# EasyEDA Pro project testpcb .eprj

# Schematic Test pcb for PUF
Board Name: Test pcb for PUF; Create Date: 2026-02-06; Page Name: Sheet_1; Project Name: PCB Test Board; Schematic Name: Test pcb for PUF; Update Date: 2026-02-05; Add into BOM: yes; Company: Your Company; Convert to PCB: yes; Date: 2026-02-02; Draw By: imonlylegendary; REV: 1.0; Sheet: 1/1; spicePre: .
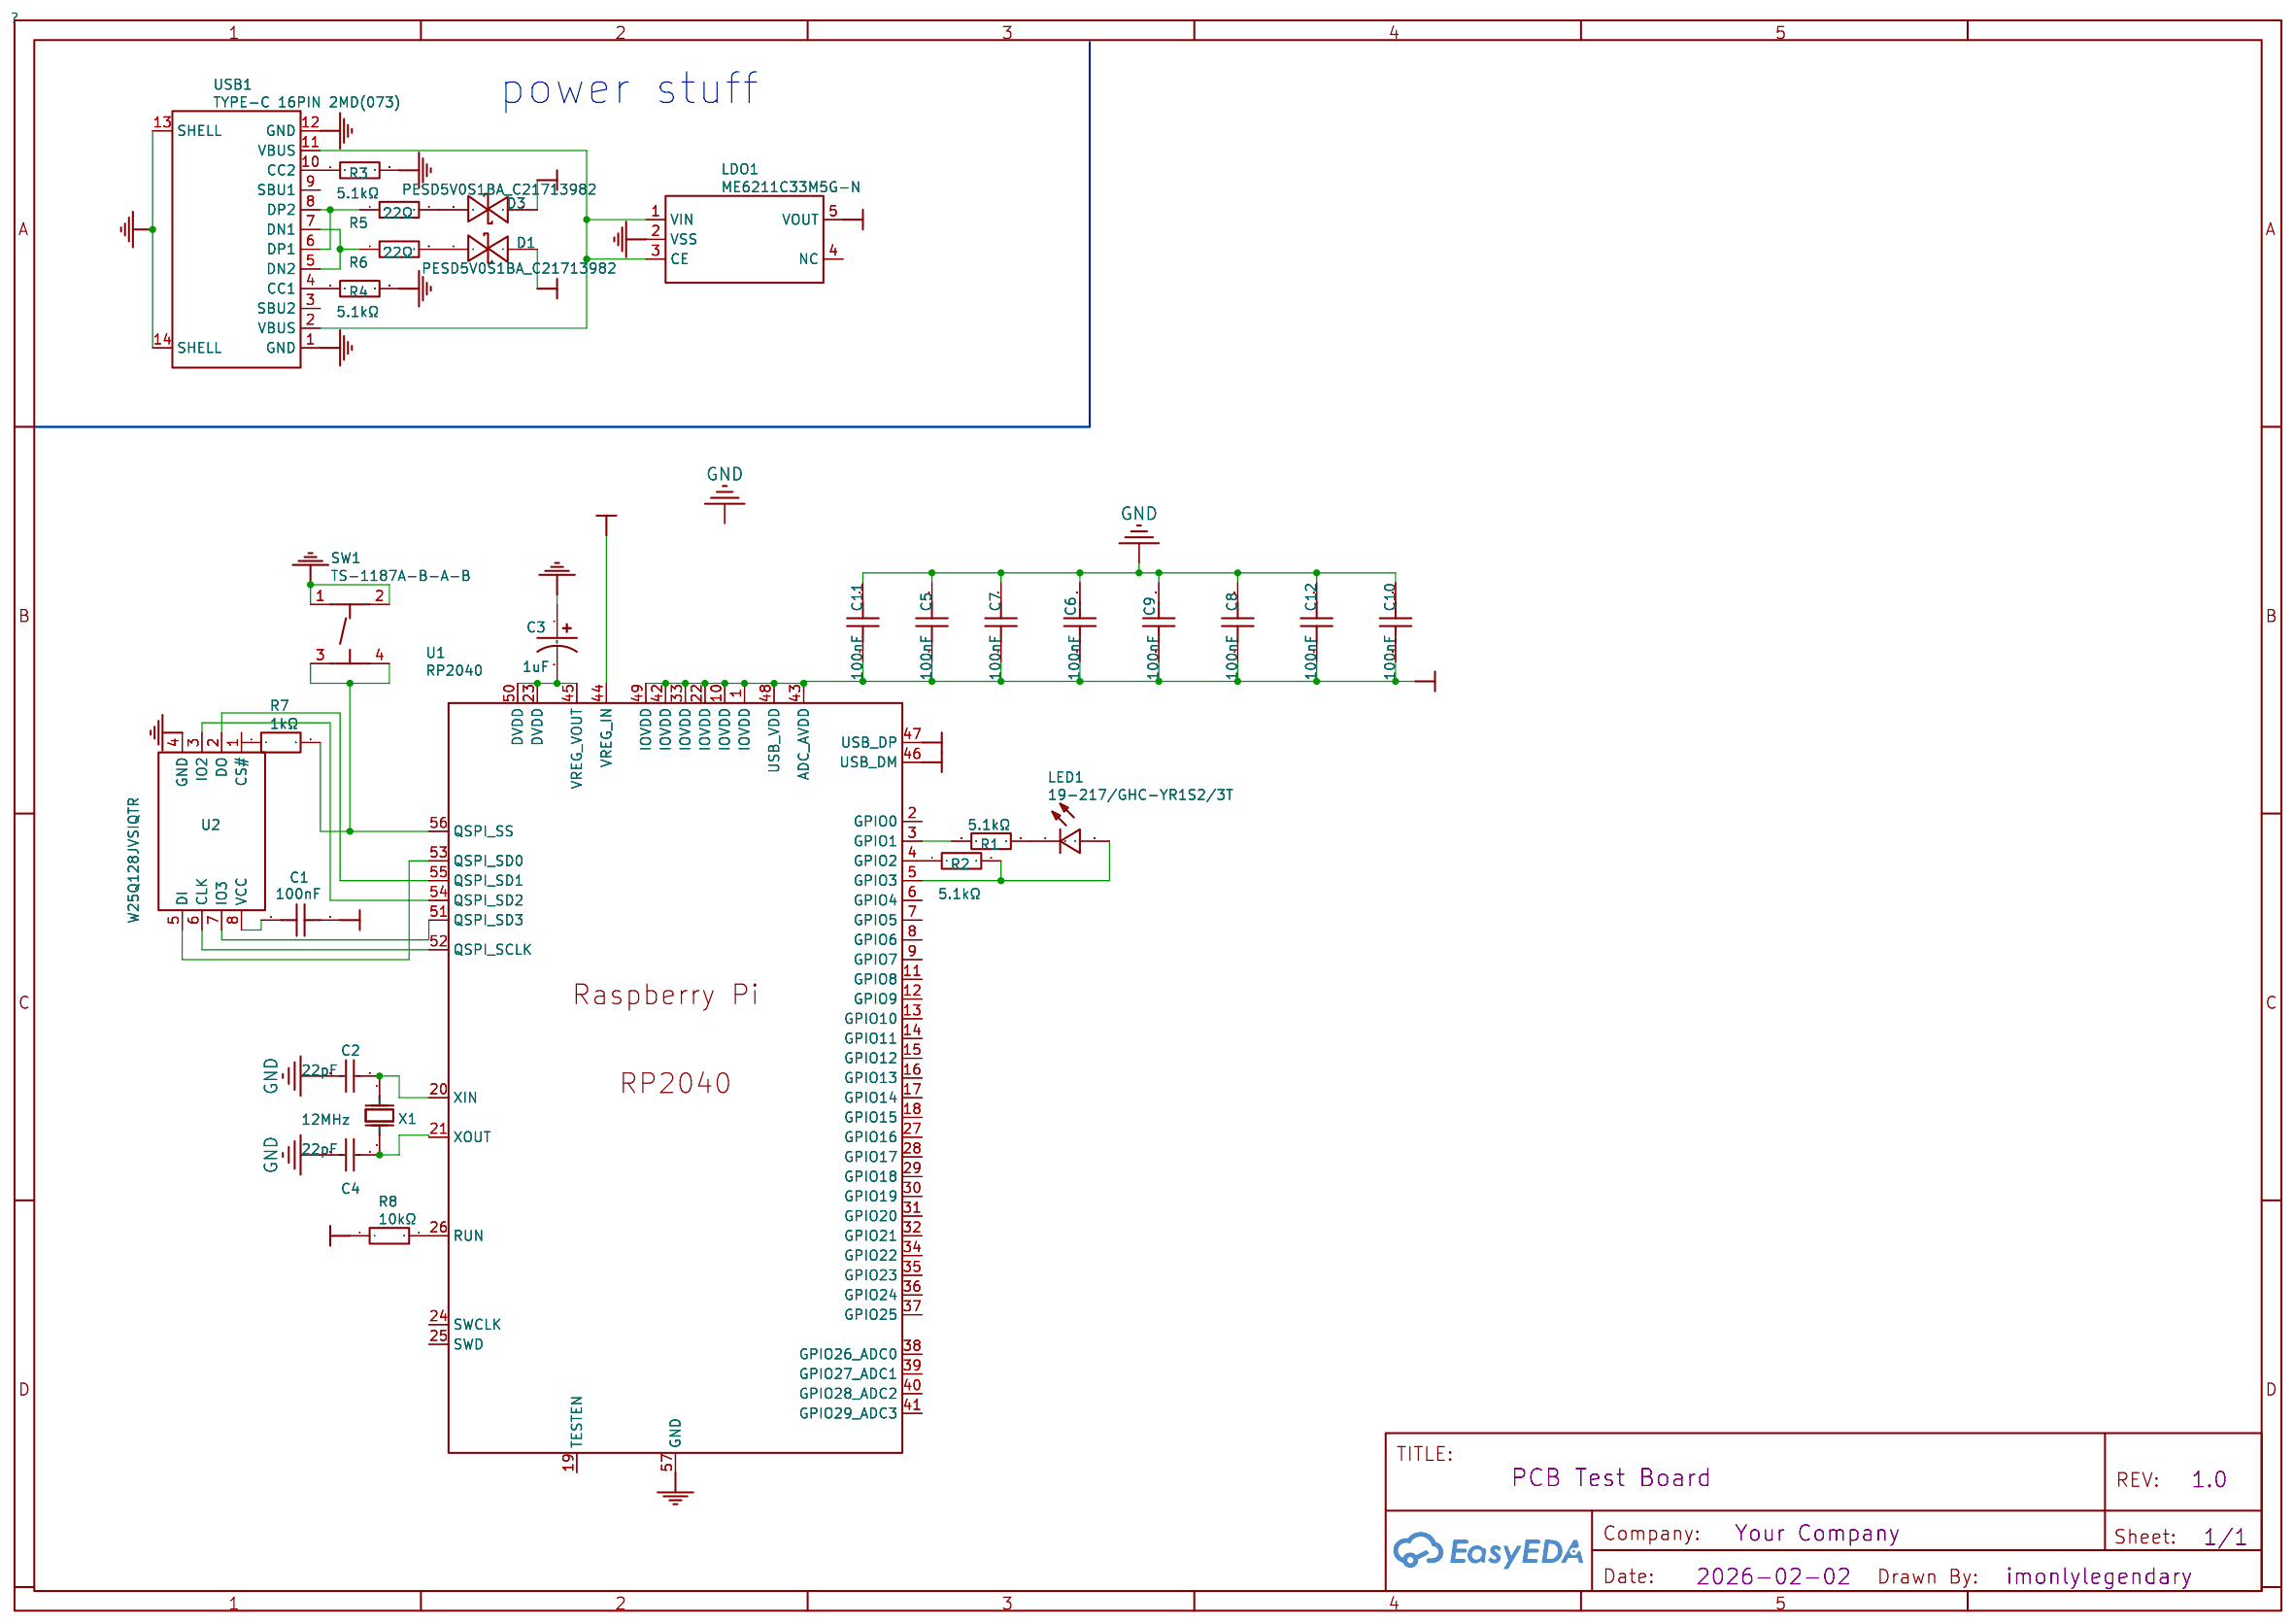
[diagram p0: schematic sheet]

## Parts
C1  100nF  [C0402]
C2  22pF  [C0603]
C3  1uF  [CAP-TH_BD5.0-P2.00-D0.5-FD-1]
C4  22pF  [C0603]
C5  100nF  [C0603]
C6  100nF  [C0603]
C7  100nF  [C0603]
C8  100nF  [C0603]
C9  100nF  [C0603]
C10  100nF  [C0603]
C11  100nF  [C0603]
C12  100nF  [C0603]
D1  PESD5V0S1BA_C21713982  [SOD-323_L1.7-W1.3-LS2.5-BI]
D3  PESD5V0S1BA_C21713982  [SOD-323_L1.7-W1.3-LS2.5-BI]
LDO1  ME6211C33M5G-N  [SOT-23-5_L3.0-W1.7-P0.95-LS2.8-BL]
LED1  19-217/GHC-YR1S2/3T  [LED0603-RD]
R1  5.1kΩ  [R0603]
R2  5.1kΩ  [R0603]
R3  5.1kΩ  [R0603]
R4  5.1kΩ  [R0603]
R5  22Ω  [R0603]
R6  22Ω  [R0603]
R7  1kΩ  [R0603]
R8  10kΩ  [R0603]
SW1  TS-1187A-B-A-B  [SW-SMD_4P-L5.1-W5.1-P3.70-LS6.5-TL_H1.5]
U1  RP2040  [LQFN-56_L7.0-W7.0-P0.4-EP]
U2  W25Q128JVSIQTR  [SOIC-8_L5.3-W5.3-P1.27-LS8.0-BL]
USB1  TYPE-C 16PIN 2MD(073)  [USB-C-SMD_TYPE-C-6PIN-2MD-073]
X1  12MHz  [HC-49US_L11.5-W4.5-P4.88]

## Library data of the parts
C1 = 100nF: Supplier: LCSC; Supplier Part: C307331; Manufacturer: SAMSUNG(三星); Manufacturer Part: CL05B104KB54PNC; JLCPCB Part Class: Basic Part; nameAlias: Value; Contributor: LCSC; spicePre: C; spiceSymbolName: CL05B104KB54PNC
C2 C4 = 22pF: Supplier: LCSC; Manufacturer Part: CL10C220JB8NNNC; Manufacturer: SAMSUNG(三星); Supplier Part: C1653; JLCPCB Part Class: Basic Part; nameAlias: Value; spicePre: C; spiceSymbolName: CL10C220JB8NNNC
C3 = 1uF: Supplier: LCSC; Supplier Part: C2927584; Manufacturer: rubycon(红宝石); Manufacturer Part: 50YXF1MEFC5X11; JLCPCB Part Class: Extended Part; Contributor: lcsc; nameAlias: Value; spicePre: C; spiceSymbolName: 50YXF1MEFC5X11_C2927584
C5-C12 = 100nF: Supplier: LCSC; Manufacturer: YAGEO(国巨); Manufacturer Part: CC0603KRX7R9BB104; Supplier Part: C14663; JLCPCB Part Class: Basic Part; link: https://lcsc.com/eda_search?q=C14663&%26type=1&ref=editor; nameAlias: Value; spicePre: C; spiceSymbolName: CC0603KRX7R9BB104
D1 D3 = PESD5V0S1BA_C21713982: Supplier: LCSC; Supplier Part: C21713982; Manufacturer: GOODWORK(固得沃克); Manufacturer Part: PESD5V0S1BA; JLCPCB Part Class: Extended Part; Contributor: lcsc; spicePre: D
LDO1 = ME6211C33M5G-N: Supplier: LCSC; Manufacturer: MICRONE(南京微盟); Supplier Part: C82942; JLCPCB Part Class: Extended Part; spicePre: L
LED1 = 19-217/GHC-YR1S2/3T: Supplier: LCSC; Manufacturer: EVERLIGHT(亿光); Supplier Part: C72043; JLCPCB Part Class: Extended Part; spicePre: L
R1-R4 = 5.1kΩ: Supplier: LCSC; Manufacturer Part: 0603WAF5101T5E; Manufacturer: UNI-ROYAL(厚声); Supplier Part: C23186; JLCPCB Part Class: Basic Part; nameAlias: Value; spicePre: R; spiceSymbolName: 0603WAF5101T5E
R5 R6 = 22Ω: Supplier: LCSC; Manufacturer: UNI-ROYAL(厚声); Manufacturer Part: 0603WAF220JT5E; Supplier Part: C23345; JLCPCB Part Class: Basic Part; nameAlias: Value; spicePre: R; spiceSymbolName: 0603WAF220JT5E
R7 = 1kΩ: Supplier: LCSC; Supplier Part: C2907002; Manufacturer: FOJAN(富捷); Manufacturer Part: FRC0603F1001TS; JLCPCB Part Class: Extended Part; nameAlias: Value; Contributor: lcsc; spicePre: R; spiceSymbolName: FRC0603F1001TS
R8 = 10kΩ: Supplier: LCSC; Manufacturer: UNI-ROYAL(厚声); Manufacturer Part: 0603WAF1002T5E; Supplier Part: C25804; JLCPCB Part Class: Basic Part; nameAlias: Value; spicePre: R; spiceSymbolName: 0603WAF1002T5E
SW1 = TS-1187A-B-A-B: Supplier: LCSC; Supplier Part: C318884; Manufacturer: XKB Connection(中国星坤); JLCPCB Part Class: Basic Part; Contributor: LCSC; spicePre: S
U1 = RP2040: Supplier: LCSC; Supplier Part: C2040; Manufacturer: Raspberry Pi(树莓派); JLCPCB Part Class: Extended Part; Contributor: LCSC; spicePre: U
U2 = W25Q128JVSIQTR: Supplier: LCSC; Manufacturer: Winbond(华邦); Manufacturer Part: W25Q128JVSIQ; Supplier Part: C97521; JLCPCB Part Class: Basic Part; spicePre: U
USB1 = TYPE-C 16PIN 2MD(073): Supplier: LCSC; Supplier Part: C2765186; Manufacturer: SHOU HAN(首韩); JLCPCB Part Class: Extended Part; Contributor: LCSC; spicePre: U
X1 = 12MHz: Supplier: LCSC; Manufacturer: YXC(扬兴晶振); Manufacturer Part: X49SD12MSD2SC; Supplier Part: C16369; JLCPCB Part Class: Extended Part; nameAlias: Value; spicePre: X; spiceSymbolName: X49SD12MSD2SC

## Nets
3.3V: C1.2 C5.1 C6.1 C7.1 C8.1 C9.1 C10.1 C11.1 C12.1 LDO1.5(VOUT) R8.1 U1.44(VREG_IN)
GND: C2.1 C3.1 C4.1 C5.2 C6.2 C7.2 C8.2 C9.2 C10.2 C11.2 C12.2 LDO1.2(VSS) R3.2 R4.2 SW1.1(A) SW1.2(B) U1.57(GND) U2.4(GND) USB1.1(GND) USB1.12(GND) USB1.13(SHELL) USB1.14(SHELL)
D+: D3.2(K) U1.47(USB_DP)
D-: D1.2(K) U1.46(USB_DM)
Net-(C1-1): C1.1 U2.8(VCC)
Net-(C2-2): C2.2 U1.20(XIN) X1.1(OSC1)
Net-(C3-2): C3.2 U1.23(DVDD) U1.45(VREG_VOUT) U1.50(DVDD)
Net-(C4-2): C4.2 U1.21(XOUT) X1.2(OSC2)
Net-(D1-1): D1.1(A) R6.2
Net-(D3-1): D3.1(A) R5.2
Net-(LDO1-1): LDO1.1(VIN) LDO1.3(CE) USB1.2(VBUS) USB1.11(VBUS)
Net-(LED1-1): LED1.1(C) R1.2
Net-(LED1-2): LED1.2(A) R2.2 U1.5(GPIO3)
Net-(R1-1): R1.1 U1.3(GPIO1)
Net-(R2-1): R2.1 U1.4(GPIO2)
Net-(R3-1): R3.1 USB1.10(CC2)
Net-(R4-1): R4.1 USB1.4(CC1)
Net-(R5-1): R5.1 USB1.6(DP1) USB1.8(DP2)
Net-(R6-1): R6.1 USB1.5(DN2) USB1.7(DN1)
Net-(R7-1): R7.1 U2.1(CS#)
Net-(R7-2): R7.2 SW1.3(C) SW1.4(D) U1.56(QSPI_SS)
Net-(R8-2): R8.2 U1.26(RUN)
Net-(U1-1): U1.1(IOVDD) U1.10(IOVDD) U1.22(IOVDD) U1.33(IOVDD) U1.42(IOVDD) U1.43(ADC_AVDD) U1.48(USB_VDD) U1.49(IOVDD)
Net-(U1-51): U1.51(QSPI_SD3) U2.7(IO3)
Net-(U1-52): U1.52(QSPI_SCLK) U2.6(CLK)
Net-(U1-53): U1.53(QSPI_SD0) U2.5(DI)
Net-(U1-54): U1.54(QSPI_SD2) U2.3(IO2)
Net-(U1-55): U1.55(QSPI_SD1) U2.2(DO)

Not connected (* = marked no-connect by the designer): LDO1 4(NC); U1 2(GPIO0) 6(GPIO4) 7(GPIO5) 8(GPIO6) 9(GPIO7) 11(GPIO8) 12(GPIO9) 13(GPIO10) 14(GPIO11) 15(GPIO12) 16(GPIO13) 17(GPIO14) 18(GPIO15) 19(TESTEN) 24(SWCLK) 25(SWD) 27(GPIO16) 28(GPIO17) 29(GPIO18) 30(GPIO19) 31(GPIO20) 32(GPIO21) 34(GPIO22) 35(GPIO23) 36(GPIO24) 37(GPIO25) 38(GPIO26_ADC0) 39(GPIO27_ADC1) 40(GPIO28_ADC2) 41(GPIO29_ADC3); USB1 3(SBU2) 9(SBU1)

## Notes on the sheet
- power stuff
